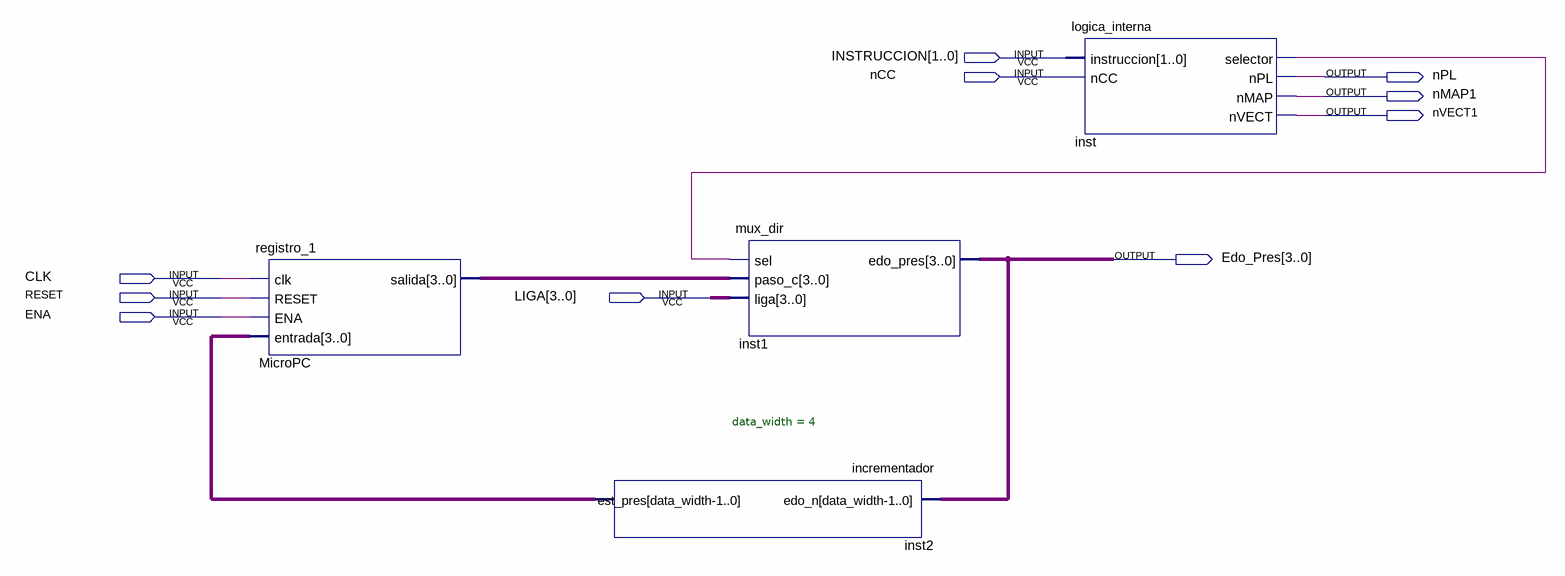
[diagram p0: schematic sheet]
// Quartus schematic secuenciador.bdf as structural Verilog: 4 symbols, 10 pins
module secuenciador (
  input  [1:0] INSTRUCCION,
  input  nCC,
  input  CLK,
  input  RESET,
  input  [3:0] LIGA,
  input  ENA,
  output nPL,
  output nMAP1,
  output nVECT1,
  output [3:0] Edo_Pres
);

  wire inst_selector;
  wire [3:0] inst2_est_pres, MicroPC_salida;

  registro_1 MicroPC (.clk(CLK), .RESET(RESET), .ENA(ENA), .entrada(inst2_est_pres), .salida(MicroPC_salida));
  incrementador #(.data_width(4)) inst2 (.edo_n(Edo_Pres), .est_pres(inst2_est_pres));
  mux_dir inst1 (.sel(inst_selector), .paso_c(MicroPC_salida), .liga(LIGA), .edo_pres(Edo_Pres));
  logica_interna inst (
    .instruccion(INSTRUCCION), .nCC(nCC), .selector(inst_selector), .nPL(nPL), .nMAP(nMAP1), .nVECT(nVECT1));
endmodule
